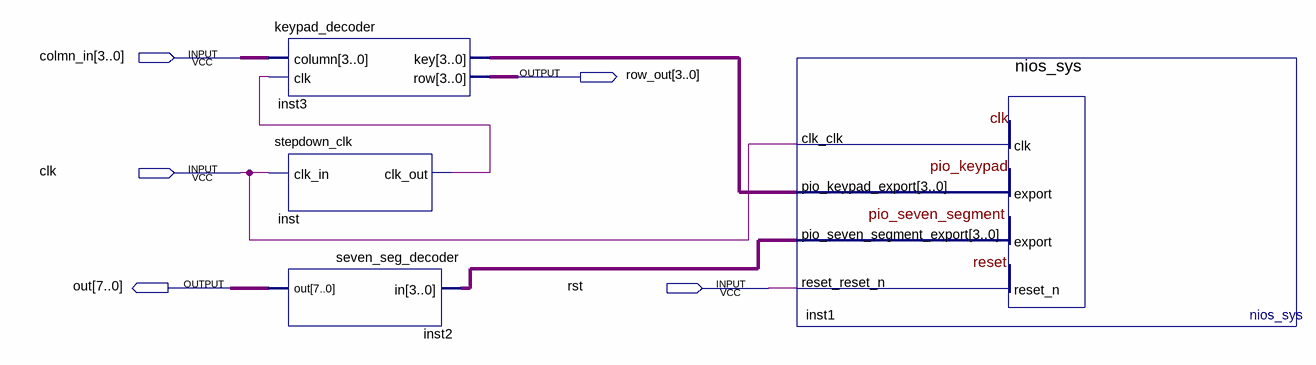
[diagram p0: schematic sheet]
// Quartus schematic seven_segment_keypad.bdf as structural Verilog: 4 symbols, 5 pins
module seven_segment_keypad (
  input  [3:0] colmn_in,
  input  clk,
  input  rst,
  output [3:0] row_out,
  output [7:0] out
);

  wire inst_clk_out;
  wire [3:0] inst1_pio_seven_segment_export, inst3_key;

  keypad_decoder inst3 (.column(colmn_in), .clk(inst_clk_out), .key(inst3_key), .row(row_out));
  stepdown_clk inst (.clk_in(clk), .clk_out(inst_clk_out));
  seven_seg_decoder inst2 (.in(inst1_pio_seven_segment_export), .out(out));
  nios_sys inst1 (
    .clk_clk(clk), .pio_keypad_export(inst3_key), .reset_reset_n(rst),
    .pio_seven_segment_export(inst1_pio_seven_segment_export));
endmodule
